# Altium schematic sheet [6] Power.SchDoc: On / Off Controller
size A3; SheetNumber: 6; SheetTotal: 6
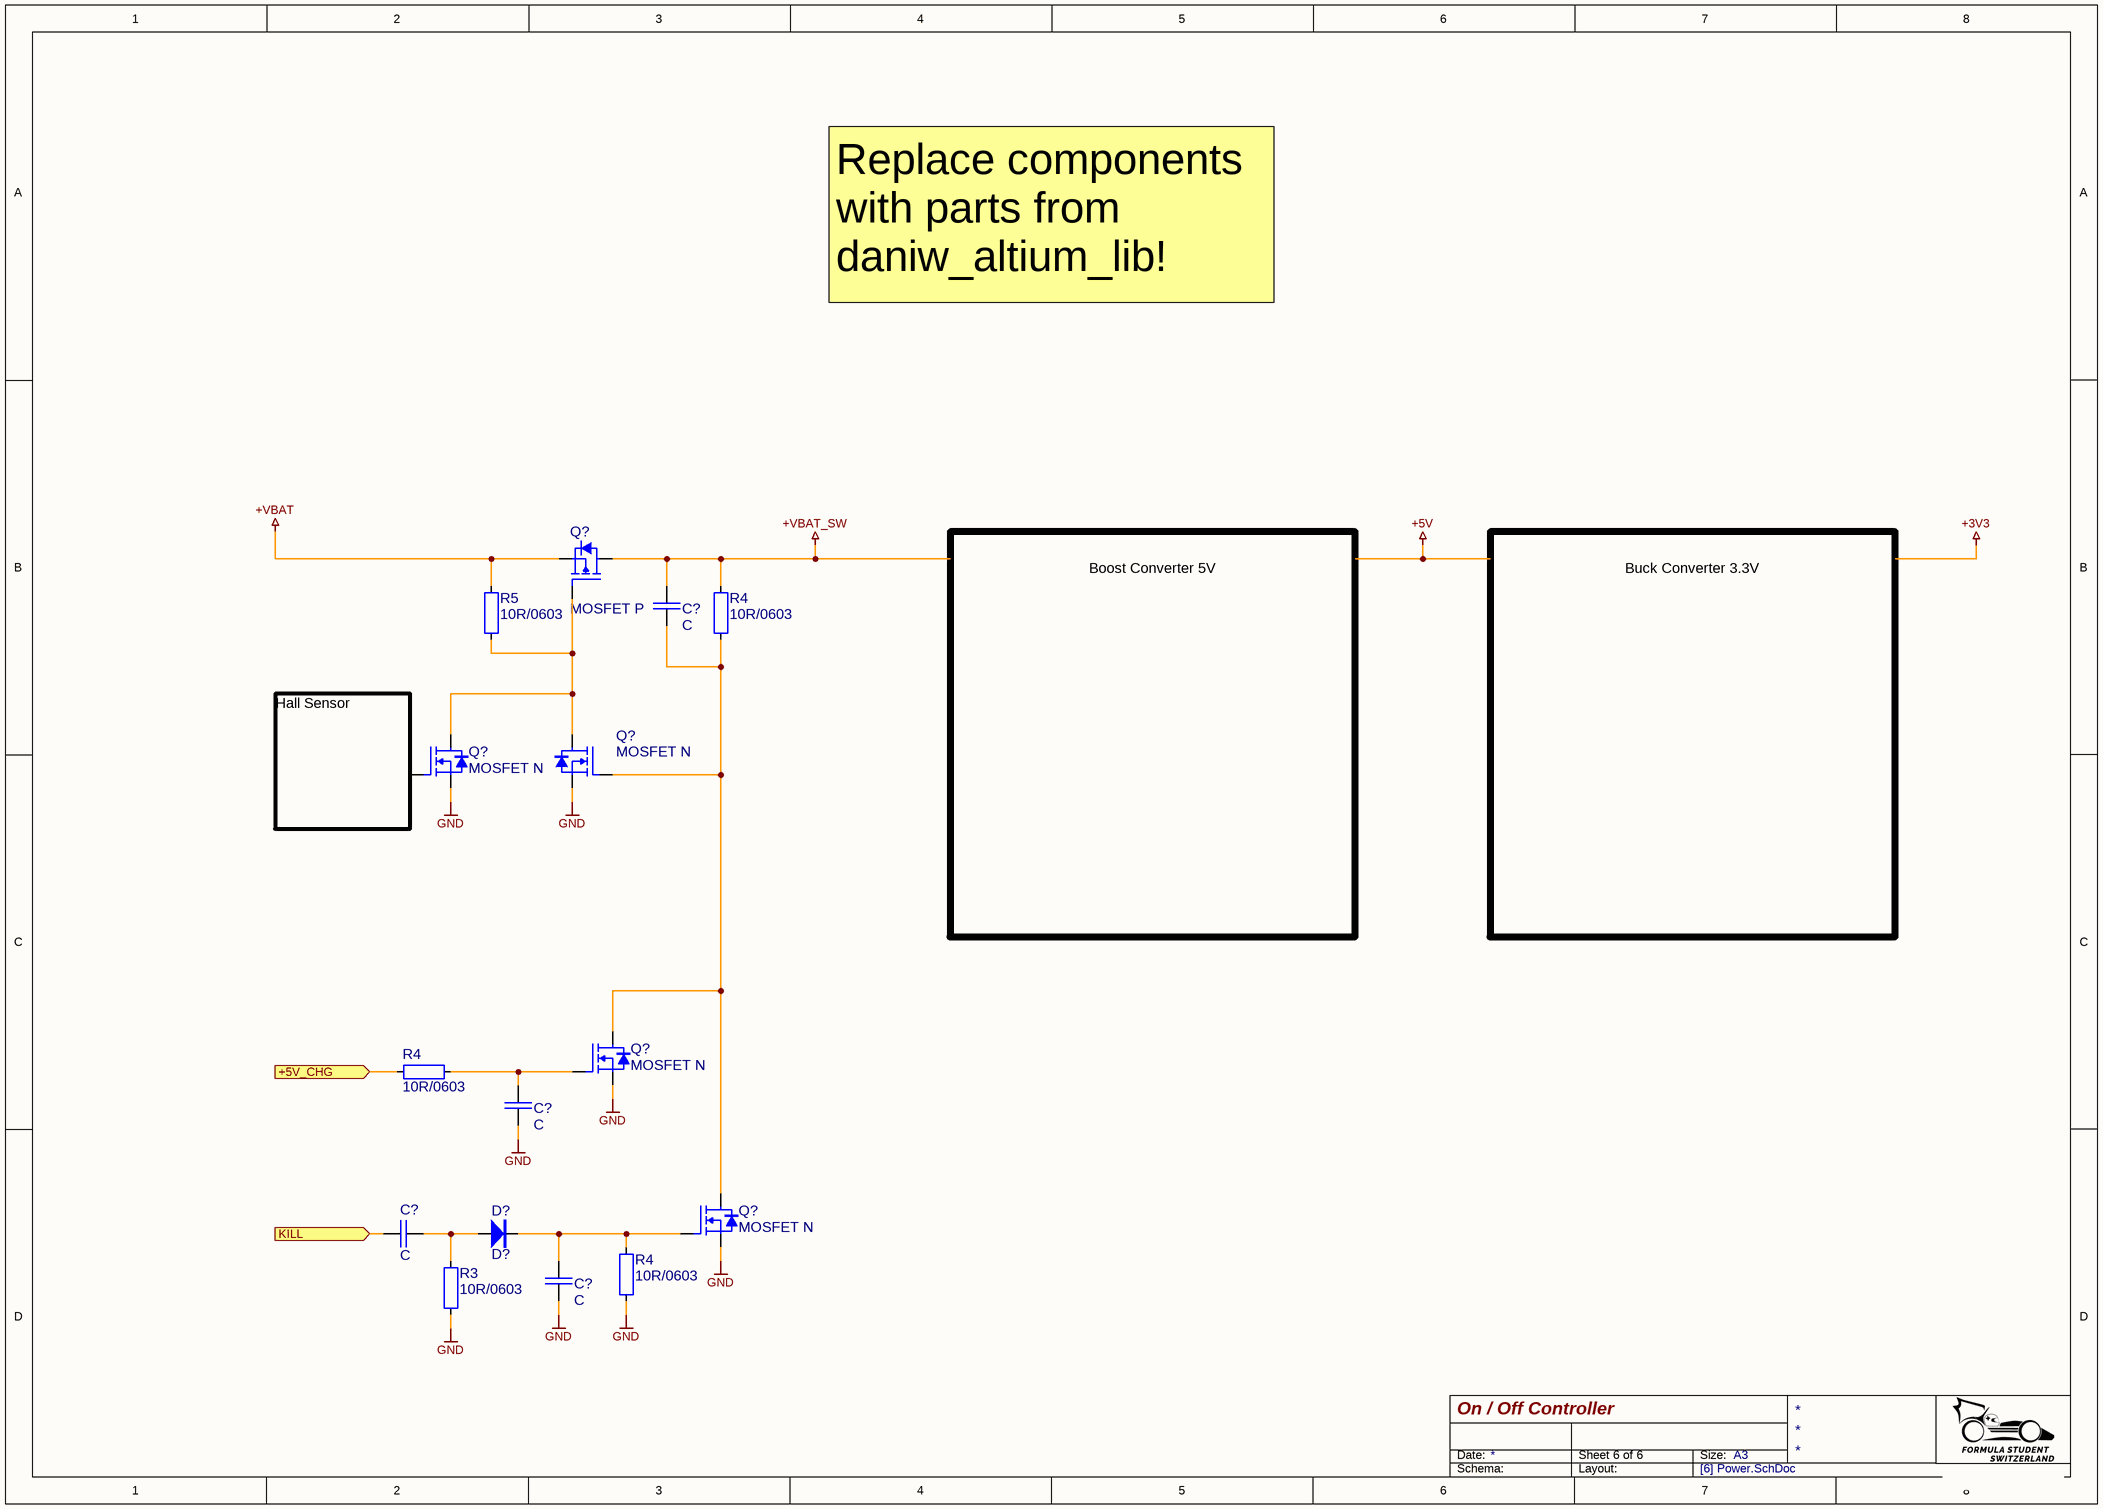
[diagram p0: [6] Power.SchDoc]

## Parts
(Parts that share a designator on the sheet are numbered #1, #2 ... from top to bottom, then left to right.)
C?#1  C  [C_TDK_B32776G5456]
C?#2  C  [C_TDK_B32776G5456]
C?#3  C  [C_TDK_B32776G5456]
C?#4  C  [C_TDK_B32776G5456]
D?  D?  [D0805]
Q?#1  MOSFET P  [TO-252AA]
Q?#2  MOSFET N  [SON5x6]
Q?#3  MOSFET N  [SON5x6]
Q?#4  MOSFET N  [SON5x6]
Q?#5  MOSFET N  [SON5x6]
R3  10R/0603  [R0603-0.40-WW]
R4#1  10R/0603  [R0603-0.40-WW]
R4#2  10R/0603  [R0603-0.40-WW]
R4#3  10R/0603  [R0603-0.40-WW]
R5  10R/0603  [R0603-0.40-WW]

## Ports
+5V_CHG (in), KILL (in)

## Nets
+VBAT: Q?#1.S(SOURCE) R5.1
+VBAT_SW: C?#1.1 Q?#1.D(DRAIN) R4#1.1
GND: C?#2.2 C?#4.2 Q?#2.S(SOURCE) Q?#3.S(SOURCE) Q?#4.S(SOURCE) Q?#5.S(SOURCE) R3.2 R4#3.2
+5V_CHG: R4#2.1 ; port +5V_CHG
KILL: C?#3.1 ; port KILL
NetC?#1_2: C?#1.2 Q?#3.G(GATE) Q?#4.D(DRAIN) Q?#5.D(DRAIN) R4#1.2
NetC?#2_1: C?#2.1 Q?#4.G(GATE) R4#2.2
NetC?#3_2: C?#3.2 D?.A R3.1
NetC?#4_1: C?#4.1 D?.K Q?#5.G(GATE) R4#3.1
NetQ?#1_G: Q?#1.G(GATE) Q?#2.D(DRAIN) Q?#3.D(DRAIN) R5.2

Not connected (* = marked no-connect by the designer): Q?#2 G(GATE)

## Notes on the sheet
- Replace components with parts from daniw_altium_lib!
- (near Q?#2) Hall Sensor
- Boost Converter 5V
- Buck Converter 3.3V
- Date:
- Size:
- A3
- Schema:
- Layout:

## Library data of the parts
D? = D?: Diode; ComponentLink1Description: 2KV Diode; ComponentLink1URL: https://www.mouser.ch/datasheet/2/54/CD214A-R150_R11600-259149.pdf
R3 R4#1-R4#3 R5 = 10R/0603: RES SM 0603 10R; Manufacturer: GENERIC; Manufacturer 1: Yageo; Manufacturer Part Number 1: RC0603FR-0710RL; Absolute Value: 10; Part Number: 10R/0603; Package: 0603; Value: 10R; HelpURL: https://www.yageo.com/upload/media/product/productsearch/datasheet/rchip/PYu-RC_Group_51_RoHS_L_12.pdf; Supplier 1: Digi-Key; Supplier Part Number 1: 311-10.0HRCT-ND; Manufacturer 2: Yageo; Manufacturer Part Number 2: RC0603FR-1010RL; Supplier 2: Digi-Key; Supplier Part Number 2: 13-RC0603FR-1010RLCT-ND